# EAGLE schematic Rocket.PCB.true (EAGLE 7.5.0)
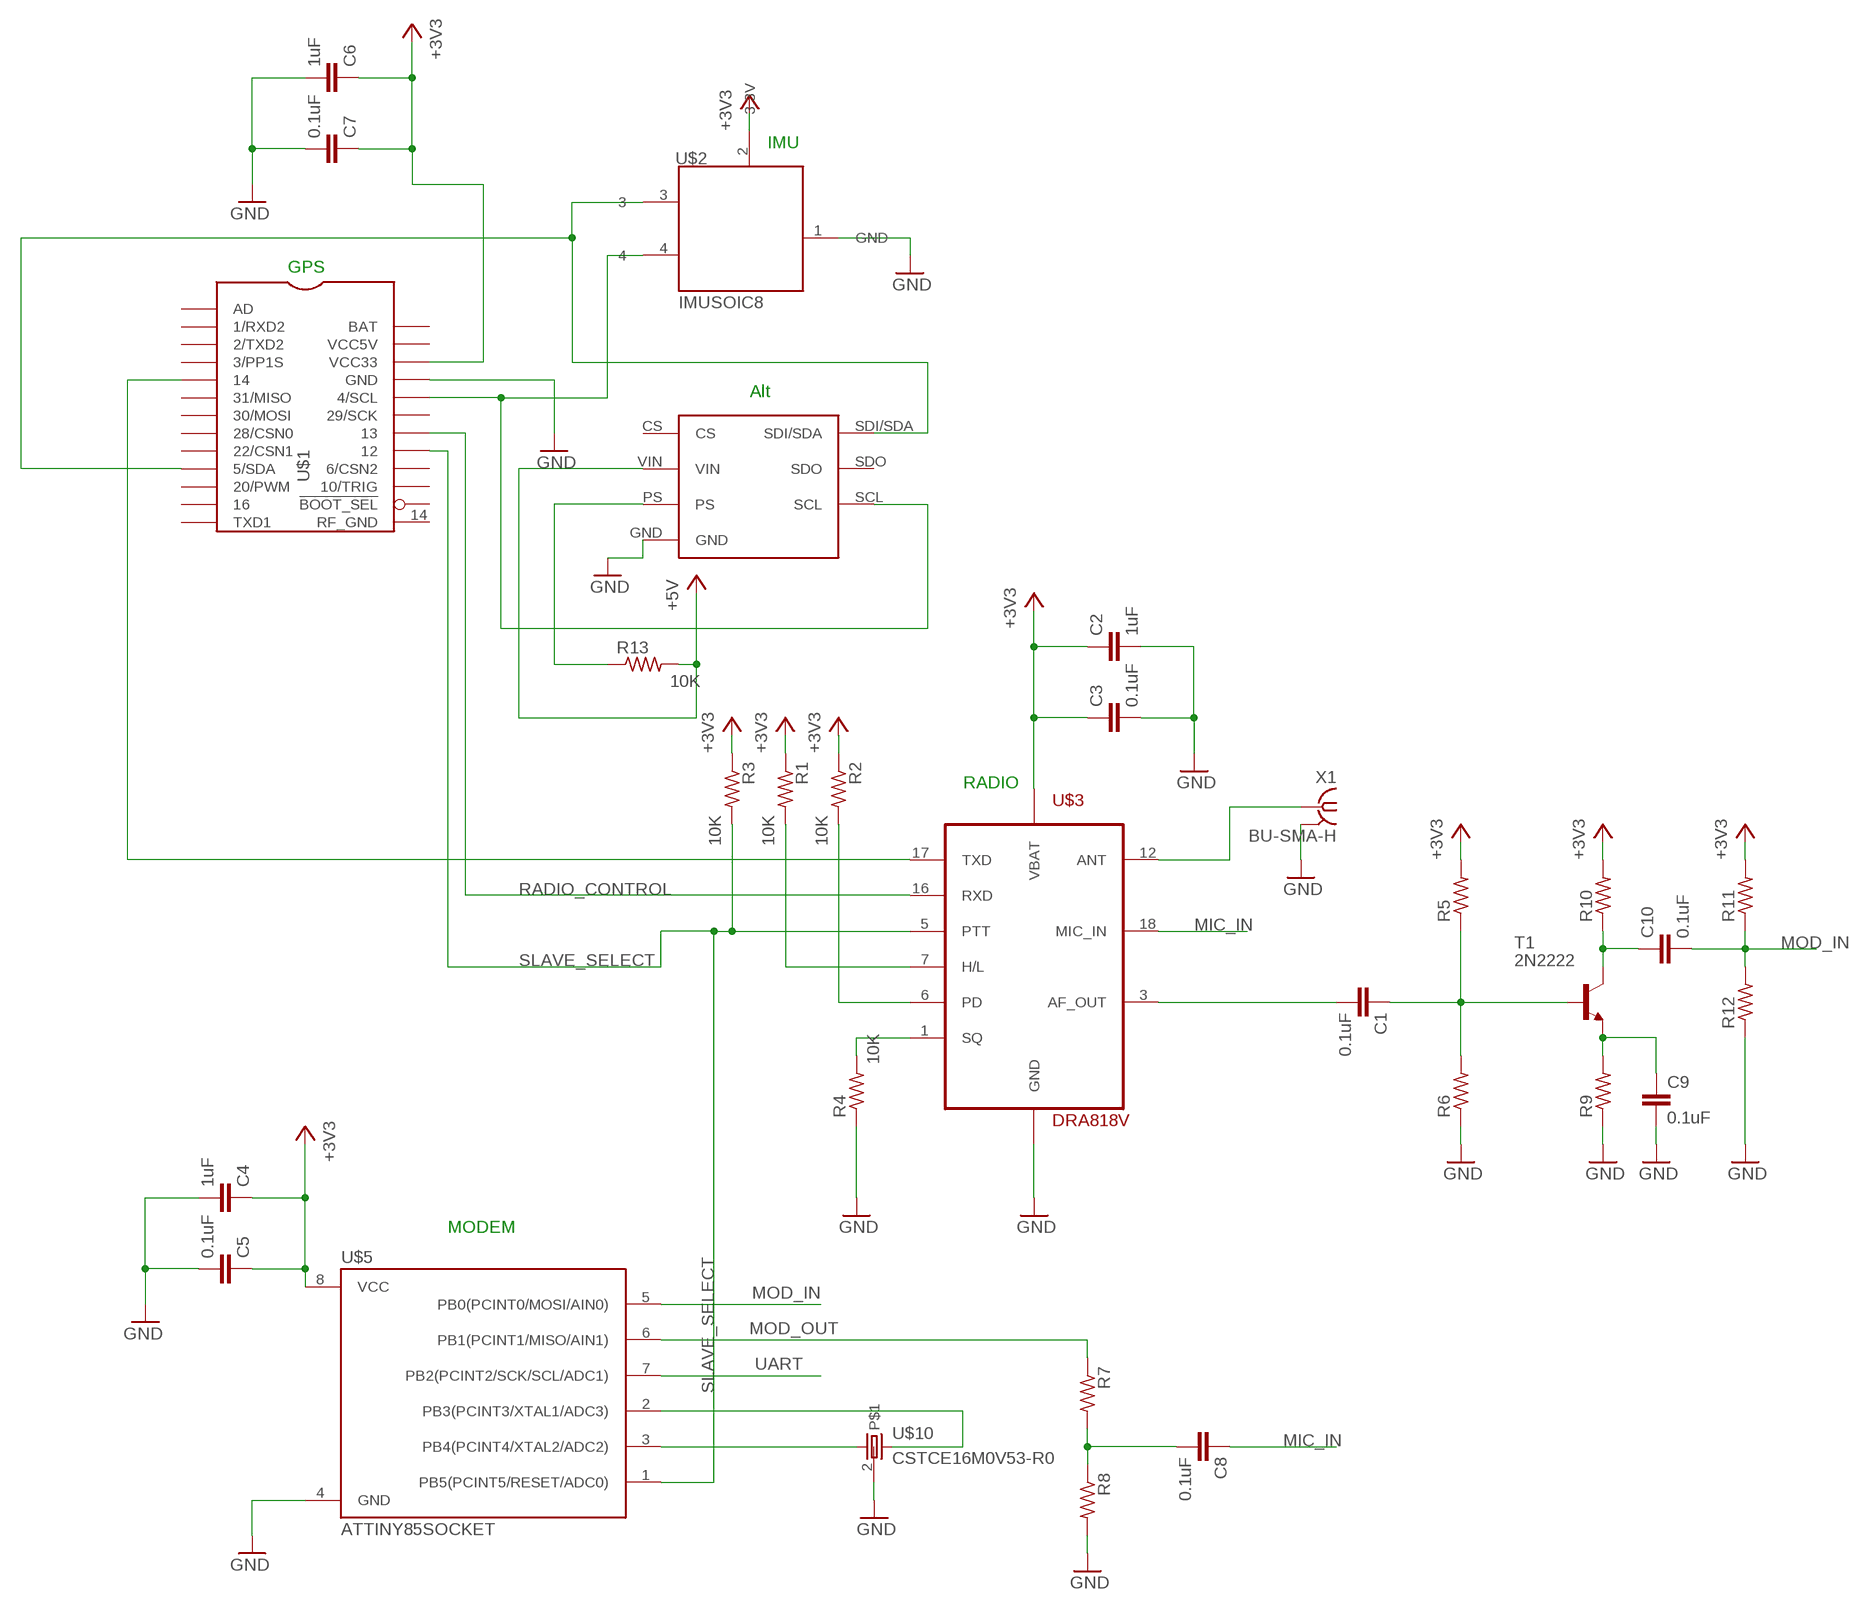
[diagram p0: schematic, sheet 1]

## Parts
C1  0.1uF  C-EUC0603  [C0603]
C2  1uF  C-EUC0603  [C0603]
C3  0.1uF  C-EUC0603  [C0603]
C4  1uF  C-EUC0603  [C0603]
C5  0.1uF  C-EUC0603  [C0603]
C6  1uF  C-EUC0603  [C0603]
C7  0.1uF  C-EUC0603  [C0603]
C8  0.1uF  C-EUC0603  [C0603]
C9  0.1uF  C-EUC0603  [C0603]
C10  0.1uF  C-EUC0603  [C0603]
R1  10K  R-US_R0603  [R0603]
R2  10K  R-US_R0603  [R0603]
R3  10K  R-US_R0603  [R0603]
R4  10K  R-US_R0603  [R0603]
R5  R-US_R0603  [R0603]
R6  R-US_R0603  [R0603]
R7  R-US_R0603  [R0603]
R8  R-US_R0603  [R0603]
R9  R-US_R0603  [R0603]
R10  R-US_R0603  [R0603]
R11  R-US_R0603  [R0603]
R12  R-US_R0603  [R0603]
R13  10K  R-US_R0603  [R0603]
T1  2N2222  [TO18]
U$1  NAVSPARK_FULL  [NAVSPARK_FULL]
U$2  IMUSOIC8  [SO08]
U$3  DRA818V  DORJIDRA818V  [DORJI]
U$4  MS-5607  [MS-5607]
U$5  ATTINY85SOCKET  [SOCKET-08]
U$10  CSTCE16M0V53-R0  [MYSMD2_RESONATOR]
X1  BU-SMA-H  [BU-SMA-H]

## Nets
+3V3: C2.1 C3.1 C4.1 C5.1 C6.1 C7.1 R1.1 R2.1 R3.1 R5.2 R10.2 R11.2 U$1.23(VCC33) U$3.8(VBAT) U$5.8(VCC)
GND: C2.2 C3.2 C4.2 C5.2 C6.2 C7.2 C9.2 R4.1 R6.1 R8.2 R9.1 R12.1 U$1.22(GND) U$3.9(GND) U$3.10(GND) U$4.GND U$5.4(GND) U$10.2 X1.2 X1.3 X1.4 X1.5
MIC_IN: C8.1 U$3.18(MIC_IN)
MOD_IN: C10.2 R11.1 R12.2 U$5.5(PB0(PCINT0/MOSI/AIN0))
MOD_OUT: R7.1 U$5.6(PB1(PCINT1/MISO/AIN1))
N$1: U$3.12(ANT) X1.1
N$2: R1.2 U$3.7(H/L)
N$3: R2.2 U$3.6(PD)
N$4: R13.2 U$4.VIN
N$5: R4.2 U$3.1(SQ)
N$6: C8.2 R7.2 R8.1
N$7: C1.1 R5.1 R6.2 T1.2(B)
N$8: C1.2 U$3.3(AF_OUT)
N$10: C9.1 R9.2 T1.1(E)
N$11: C10.1 R10.1 T1.3(C)
N$12: R13.1 U$4.PS
N$13: U$1.5 U$3.17(TXD)
N$17: U$5.2(PB3(PCINT3/XTAL1/ADC3)) U$10.3
N$18: U$5.3(PB4(PCINT4/XTAL2/ADC2)) U$10.1
RADIO_CONTROL: U$1.19 U$3.16(RXD)
SCL: U$1.21(4/SCL) U$4.SCL
SDA: U$1.10(5/SDA) U$4.SDI/SDA
SLAVE_SELECT: R3.2 U$1.18 U$3.5(PTT) U$5.1(PB5(PCINT5/RESET/ADC0))
UART: U$5.7(PB2(PCINT2/SCK/SCL/ADC1))
Unconnected: U$1.1(AD) U$1.2(1/RXD2) U$1.3(2/TXD2) U$1.4(3/PP1S) U$1.6(31/MISO) U$1.7(30/MOSI) U$1.8(28/CSN0) U$1.9(22/CSN1) U$1.11(20/PWM) U$1.12 U$1.13(TXD1) U$1.15(!BOOT_SEL) U$1.16(10/TRIG) U$1.17(6/CSN2) U$1.20(29/SCK) U$2.1(GND) U$2.2(3.3V) U$2.3 U$2.4 U$4.CS U$4.SDO

## Notes on the sheet
- IMU
- GPS
- Alt
- RADIO
- MODEM

## Power pins joined to a net without a drawn wire
BAT: U$1.25(BAT)
RF_GND: U$1.14(RF_GND)
VCC5V: U$1.24(VCC5V)

## Library data of the parts
C1-C10 = rcl:C-EU: CAPACITOR, European symbol
R1-R13 = rcl:R-US_: RESISTOR, American symbol
T1 = transistor:2N2222: NPN TRANSISTOR
U$1 = NavSpark:NAVSPARK_FULL
U$2 = rocketteam:IMU
U$3 = dorji:DORJI: DRA818V 2-Meter transceiver modul
U$4 = altimeter_module:MS-5607
U$5 = evan:ATTINY85: Atmel 14-pin 2/4/8kB flash uC
U$10 = evan:CSTCE16M0V53-R0
X1 = con-coax:BU-SMA-H: FEMALE SMA CONNECTOR Radiall; OC_FARNELL: unknown; OC_NEWARK: unknown